# EAGLE design UFI PCB Rev1 (EAGLE 7.4.0)
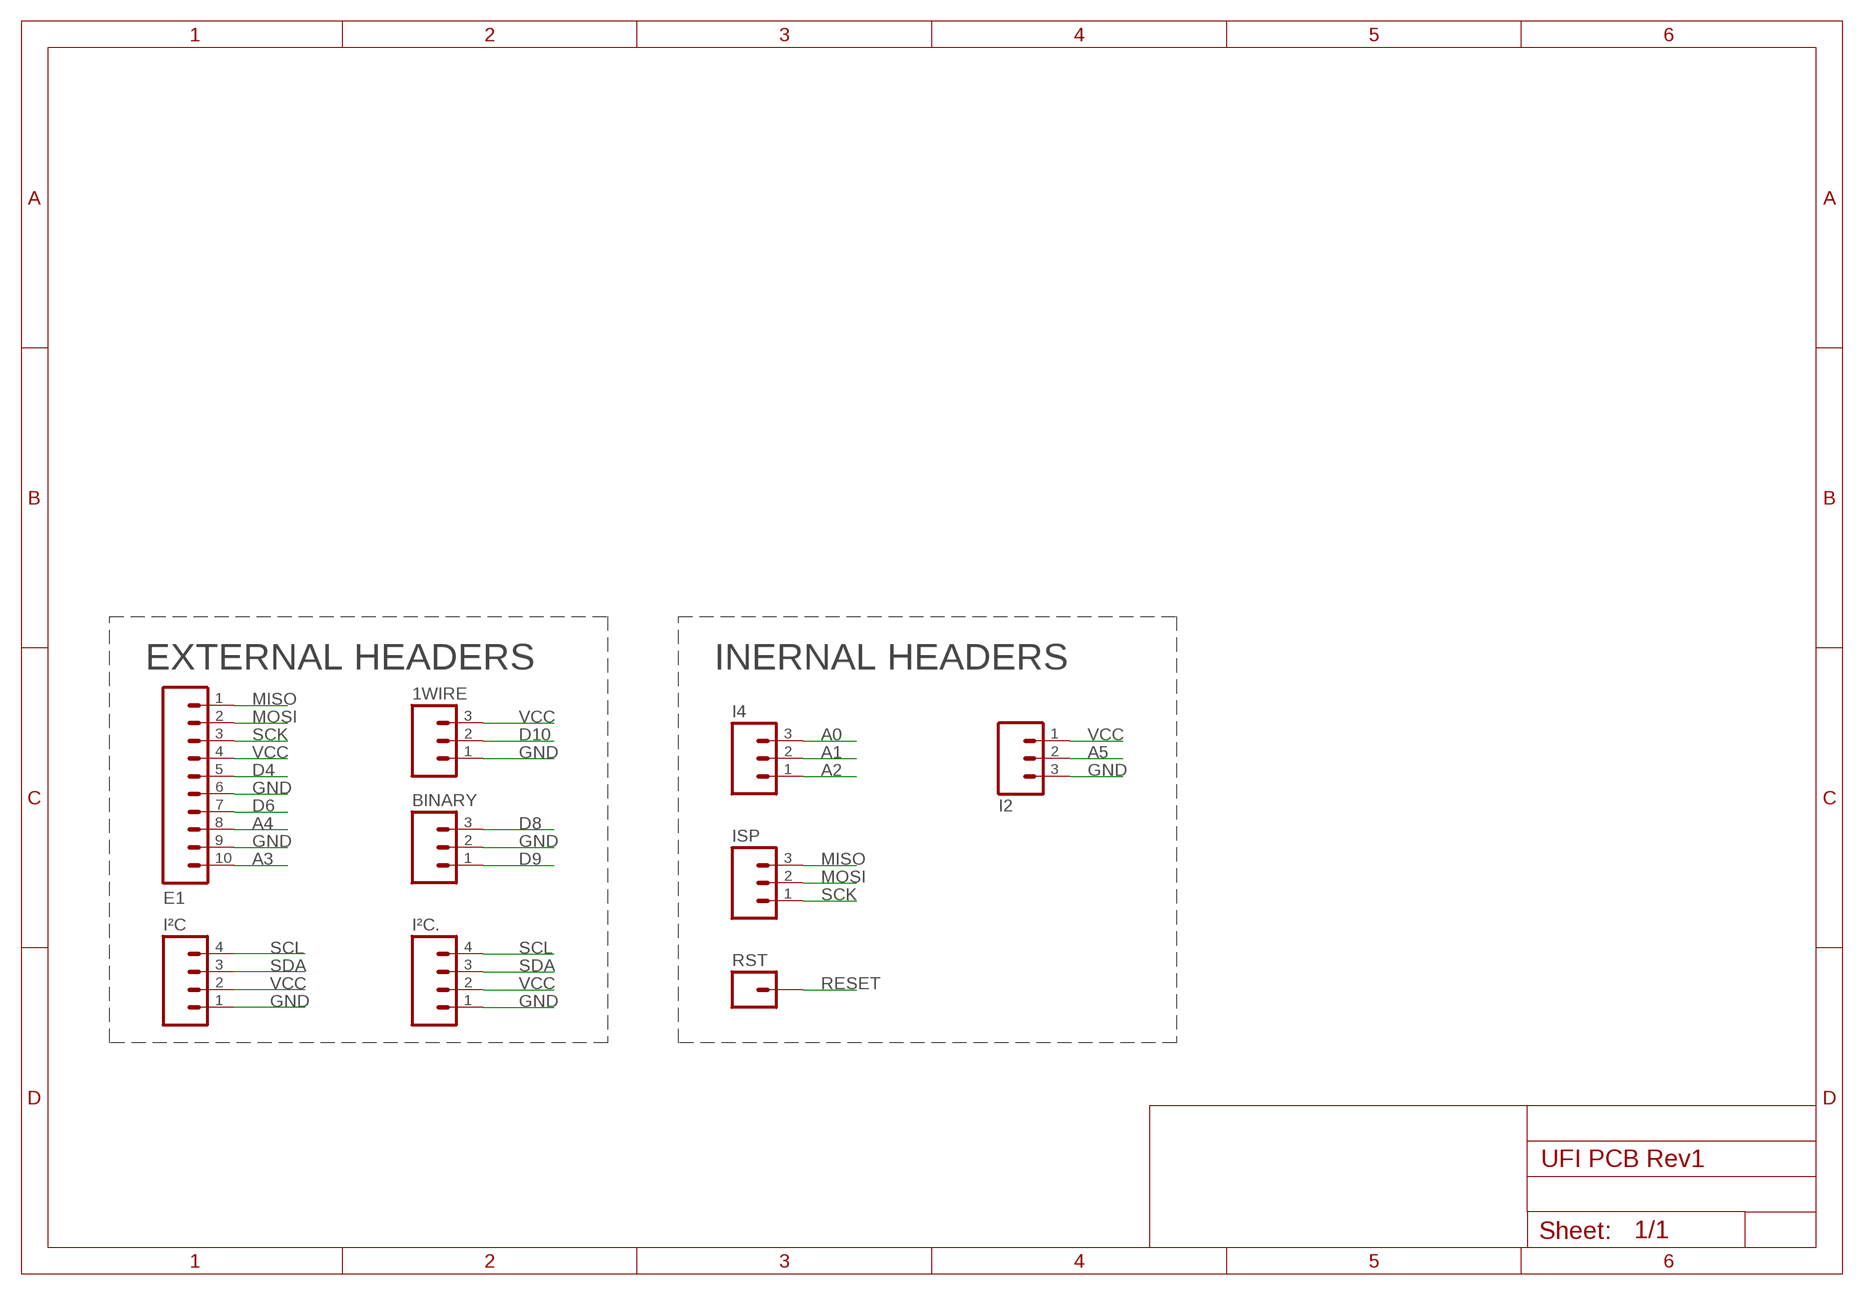
[diagram p0: schematic, sheet 1]

## Parts
1WIRE  M031X03_NO_SILK  [1X03_NO_SILK]
BINARY  M031X03_NO_SILK  [1X03_NO_SILK]
E1  M10NO_SILK_PTH_FEMALE  [1X10_NO_SILK]
I2  M031X03_NO_SILK  [1X03_NO_SILK]
I4  M031X03_NO_SILK  [1X03_NO_SILK]
ISP  M031X03_NO_SILK  [1X03_NO_SILK]
I²C  M04NO_SILK_ALL_ROUND  [1X04_NO_SILK_ALL_ROUND]
I²C.  M04NO_SILK_ALL_ROUND  [1X04_NO_SILK_ALL_ROUND]
RST  M01PTH_NO_SILK_YES_STOP  [1X01_NO_SILK]

## Nets
A0: I4.3
A1: I4.2
A2: I4.1
A3: E1.10
A4: E1.8
A5: I2.2
D4: E1.5
D6: E1.7
D8: BINARY.3
D9: BINARY.1
D10: 1WIRE.2
GND [vcc]: 1WIRE.1 BINARY.2 E1.6 E1.9 I2.3 I²C.1 I²C..1
MISO: E1.1 ISP.3
MOSI: E1.2 ISP.2
RESET: RST.1
SCK: E1.3 ISP.1
SCL: I²C.4 I²C..4
SDA: I²C.3 I²C..3
VCC: 1WIRE.3 E1.4 I2.1 I²C.2 I²C..2

## Notes on the sheet
- EXTERNAL HEADERS | INERNAL HEADERS

## Library data of the parts
1WIRE BINARY I2 I4 ISP = SparkFun-Connectors:M03: Header 3 Standard 3-pin 0.1" header. Use with straight break away headers (SKU : PRT-00116), right angle break away headers (PRT-00553), swiss pins (PRT-00743), machine pins (PRT-00117), and female headers (PRT-00115). Molex polarized connector foot print use with SKU : PRT-08232 with associated crimp pins and housings.
E1 = SparkFun-Connectors:M10: Header 10 Standard 10-pin 0.1" header. Use with straight break away headers (SKU : PRT-00116), right angle break away headers (PRT-00553), swiss pins (PRT-00743), machine pins (PRT-00117), and female headers (PRT-00115).; PROD_ID: CONN-11563
I²C I²C. = SparkFun-Connectors:M04: Header 4 Standard 4-pin 0.1" header. Use with straight break away headers (SKU : PRT-00116), right angle break away headers (PRT-00553), swiss pins (PRT-00743), machine pins (PRT-00117), and female headers (PRT-00115). Molex polarized connector foot print use with SKU : PRT-08231 with associated crimp pins and housings. 1MM SMD Version SKU: PRT-10208; PROD_ID: CONN-09696
RST = SparkFun-Connectors:M01: Header 1 Standard 1-pin 0.1" header. Use with straight break away headers (SKU : PRT-00116), right angle break away headers (PRT-00553), swiss pins (PRT-00743), machine pins (PRT-00117), and female headers (PRT-00115). SMTSO-256-ET is a "flush mount" nut for a 4-40 screw. The older package used to be too tight, and did not allow it to sit properly thru the drill hit. The latest (0.165DIA) fits nice and snug.

## Net classes
0 default: width 0.203 mm
1 vcc: width 0.254 mm

## Board
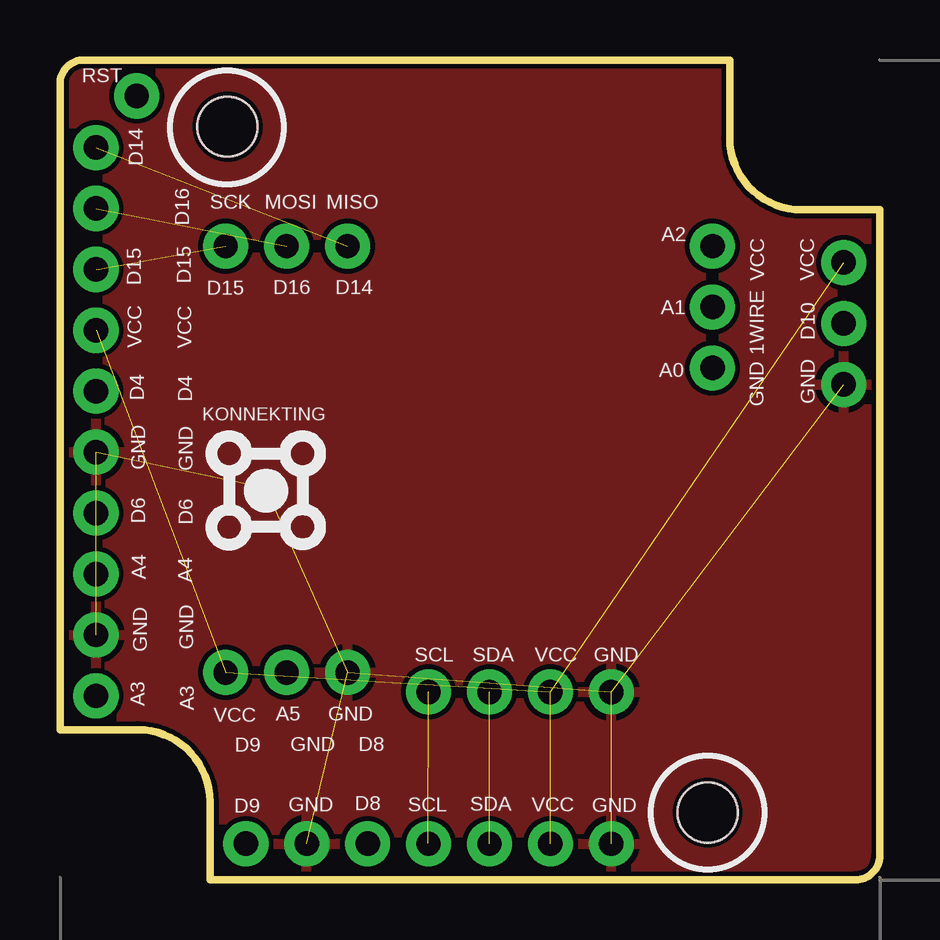
[diagram p1: board, top side]
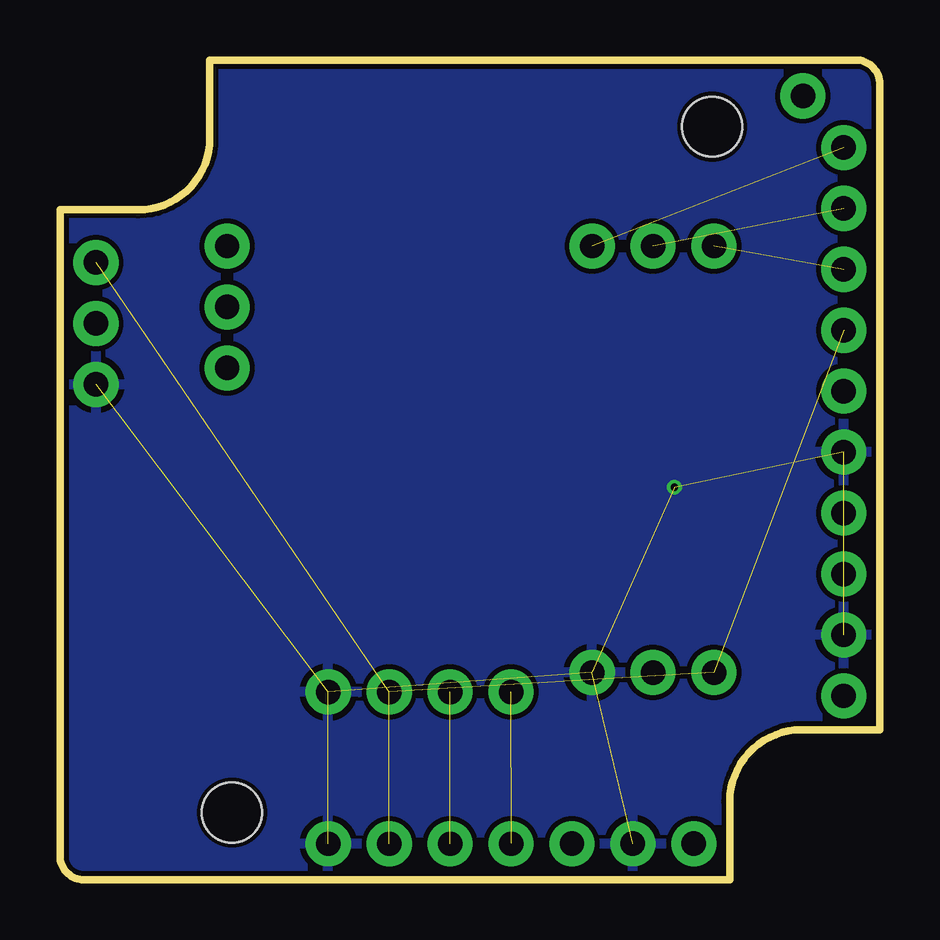
[diagram p2: board, bottom side, seen from below]

Size 34.17 x 34.17 mm. Coordinates in mm from the lower left corner, seen from the top.
Outline: 27.92,34.17 27.92,30.92 arc90 30.92,27.92 34.17,27.92 34.17,1 arc-90 33.17,0 6.25,0 6.25,3.25 arc90 3.25,6.25 0,6.25 0,33.17 arc-90 1,34.17 27.92,34.17
Copper layers (1*16): Top 0.035mm / dielectric 1.5mm / Bottom 0.035mm
Design rules "default *": minimum track width 8mil, minimum drill 24mil, track to track 8mil, track to pad 8mil, pad to pad 8mil, via to via 8mil, smd to smd 8mil, copper to edge 8mil, drill to drill 8mil, minimum pad ring 6mil, minimum via ring 6mil, stop-mask expansion 0mil, vias tented up to drill 100mil, thermal gap 10mil
Holes 2.5 mm at 27,2.79 6.98,31.39

### Footprints (pad centres in the part's own frame; a part is rotated, then mirrored left to right if it is on the bottom)
1X03_NO_SILK = drill 1.016 pad 1.88: 1 0,0; 2 2.54,0; 3 5.08,0
1X10_NO_SILK = drill 1.016 pad 1.88: 1 0,0; 2 2.54,0; 3 5.08,0; 4 7.62,0; 5 10.16,0; 6 12.7,0; 7 15.24,0; 8 17.78,0; 9 20.32,0; 10 22.86,0
1X04_NO_SILK_ALL_ROUND = drill 1.016 pad 1.88: 1 0,0; 2 2.54,0; 3 5.08,0; 4 7.62,0
1X01_NO_SILK = drill 1.016 pad 1.88: 1 0,0

### Placement (x,y rotation side)
1WIRE  32.67,20.65 90 top
BINARY  7.75,1.5 0 top
E1  1.5,30.52 270 top
I2  6.91,8.63 0 top
I4  27.2,26.41 270 top
ISP  6.91,26.41 0 top
I²C  22.99,7.82 180 top
I²C.  22.99,1.5 180 top
RST  3.2,32.67 0 top
U$1  [LOGO_5MM]  11.07,18.72 180 top

### Tracks (layer width: path | path; a pad name or v marks a point on that pad's centre or on a via)
D6
  Bottom 0.305: 1.52,15.26 E1.7
GND  (via drill 0.3)  (7 unrouted)
  other vias: 8.56,16.36
  pour Top: 0,34.17 34.17,34.17 34.17,0 0,0.1
  pour Bottom: 0,34.17 34.17,34.17 34.17,0 0,0
MISO  (1 unrouted)
MOSI  (1 unrouted)
SCK  (1 unrouted)
SCL  (1 unrouted)
  Bottom 0.305: 15.35,1.51 I²C..4
SDA  (1 unrouted)
VCC  (4 unrouted)

### Text on the board
tNames: D14 | SCK | MOSI | MISO | D16 | A2 | D15 | D15 | VCC | VCC | D15 | D16 | D14 | A1 | VCC | VCC | D10 | A0 | D4 | D4 | GND | GND | GND | GND | D6 | D6 | A4 | A4 | GND | GND | SCL | SDA | VCC | GND | A3 | A3 | A5 | GND | VCC | D9 | GND | D8 | D9 | GND | D8 | SCL | SDA | VCC | GND